# EAGLE design SecretMaze (EAGLE 7.6.0)
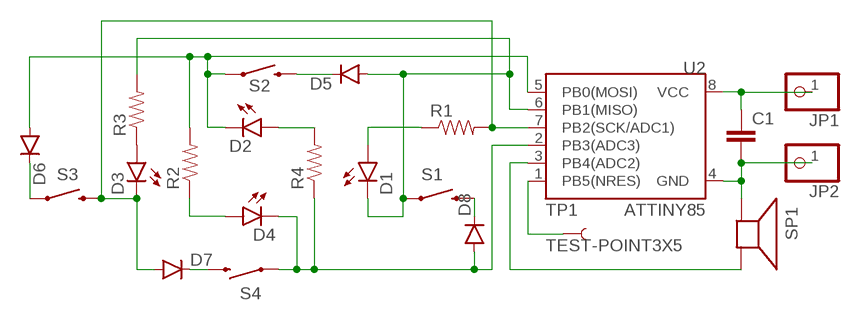
[diagram p0: schematic, sheet 1]

## Parts
C1  CAP_  [AXIAL-5MM]
D1  LED5MM  [LED5MM]
D2  LED5MM  [LED5MM]
D3  LED5MM  [LED5MM]
D4  LED5MM  [LED5MM]
D5  DIODEPTH  [DIODE-1N4001]
D6  DIODEPTH  [DIODE-1N4001]
D7  DIODEPTH  [DIODE-1N4001]
D8  DIODEPTH  [DIODE-1N4001]
JP1  PINHD-1X1CB  [1X01-CLEANBIG]
JP2  PINHD-1X1CB  [1X01-CLEANBIG]
R1  RESISTORPTH-1/4W  [AXIAL-0.4]
R2  RESISTORPTH-1/4W  [AXIAL-0.4]
R3  RESISTORPTH-1/4W  [AXIAL-0.4]
R4  RESISTORPTH-1/4W  [AXIAL-0.4]
S1  SWITCH-MOMENTARY-2PTH  [TACTILE-PTH]
S2  SWITCH-MOMENTARY-2PTH  [TACTILE-PTH]
S3  SWITCH-MOMENTARY-2PTH  [TACTILE-PTH]
S4  SWITCH-MOMENTARY-2PTH  [TACTILE-PTH]
SP1  SPEAKER/AL60P  [AL60P]
TP1  TEST-POINT3X5  [PAD.03X.05]
U2  ATTINY85  ATTINY45TINY85-20-DIP  [DIP08]

## Nets
N$1: D1.K(C) D5.A R3.P$2 S1.1 U2.6(PB1(MISO))
N$2: D7.C S4.3
N$3: SP1.2(-) U2.3(PB4(ADC2))
N$4: D3.K(C) D7.A R1.P$2 S3.3 U2.7(PB2(SCK/ADC1))
N$5: C1.P$2 JP2.1 SP1.1(+) U2.4(GND)
N$6: D8.C S1.3
N$7: D6.C S3.1
N$8: D2.A R4.P$2
N$9: D1.A R1.P$1
N$10: D3.A R3.P$1
N$11: D4.A R2.P$1
N$12: C1.P$1 JP1.1 U2.8(VCC)
N$13: D5.C S2.3
N$14: TP1.P$1 U2.1(PB5(NRES))
N$18: D2.K(C) D6.A R2.P$2 S2.1 U2.5(PB0(MOSI))
N$21: D4.K(C) D8.A R4.P$1 S4.1 U2.2(PB3(ADC3))

## Library data of the parts
C1 = SparkFun-Capacitors:CAP: Capacitor Standard 0603 ceramic capacitor, and 0.1" leaded capacitor.
D1-D4 = SparkFun-LED:LED: LEDs Standard schematic elements and footprints for 5mm, 3mm, 1206, and 0603 sized LEDs. 5mm - Spark Fun Electronics SKU : COM-00529 (and others)
D5-D8 = SparkFun-DiscreteSemi:DIODE: Diode These are standard reverse protection diodes and small signal diodes. SMA package can handle up to about 1A. SOD-323 can handle about 200mA. What the SOD-323 package when ordering, there are some mfgs out there that are 5-pin packages.
JP1 JP2 = adafruit:PINHD-1X1: Pin header 1x1 for 0.1" spacing With round pins
R1-R4 = SparkFun-Passives:RESISTOR: Resistor Basic schematic elements and footprints for 0603, 1206, and PTH resistors.
S1-S4 = SparkFun-Electromechanical:SWITCH-MOMENTARY-2: Various NO switches- pushbuttons, reed, etc; PROD_ID: SWCH-08441
SP1 = adafruit:SPEAKER: SPEAKER Source: Buerklin Added PS12 (for part # PS1240 piezo) http://www.ladyada.net/library/pcb/eaglelibrary.html
TP1 = SparkFun-Passives:TEST-POINT: Bare copper test points for troubleshooting or ICT
U2 = SparkFun-DigitalIC:ATTINY45: Atmel 8-pin 2/4/8kB flash uC; PROD_ID: IC-09445; VALUE: TINY85-20-DIP

## Board
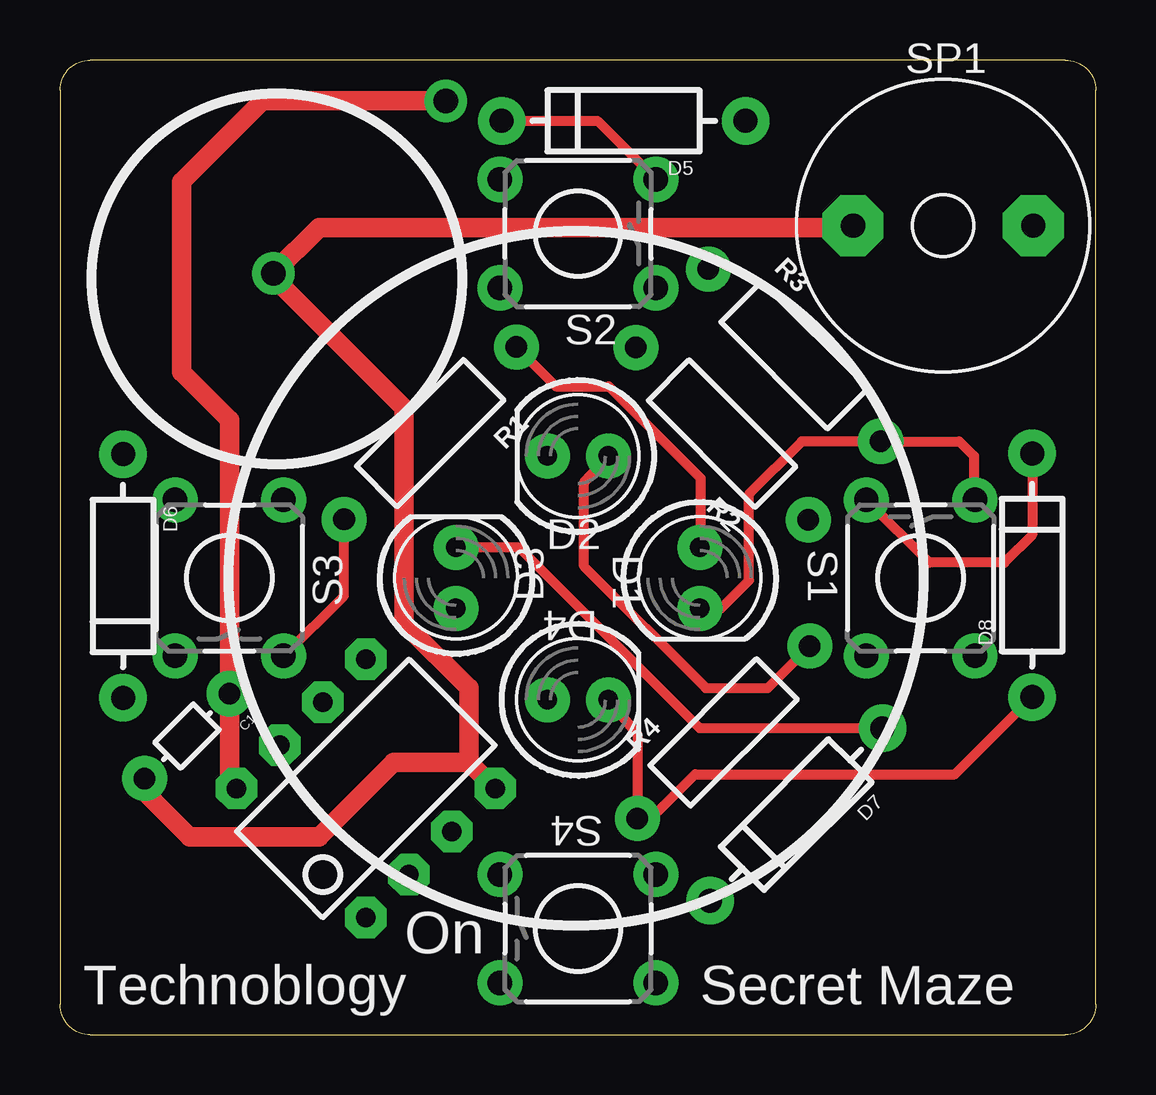
[diagram p1: board, top side]
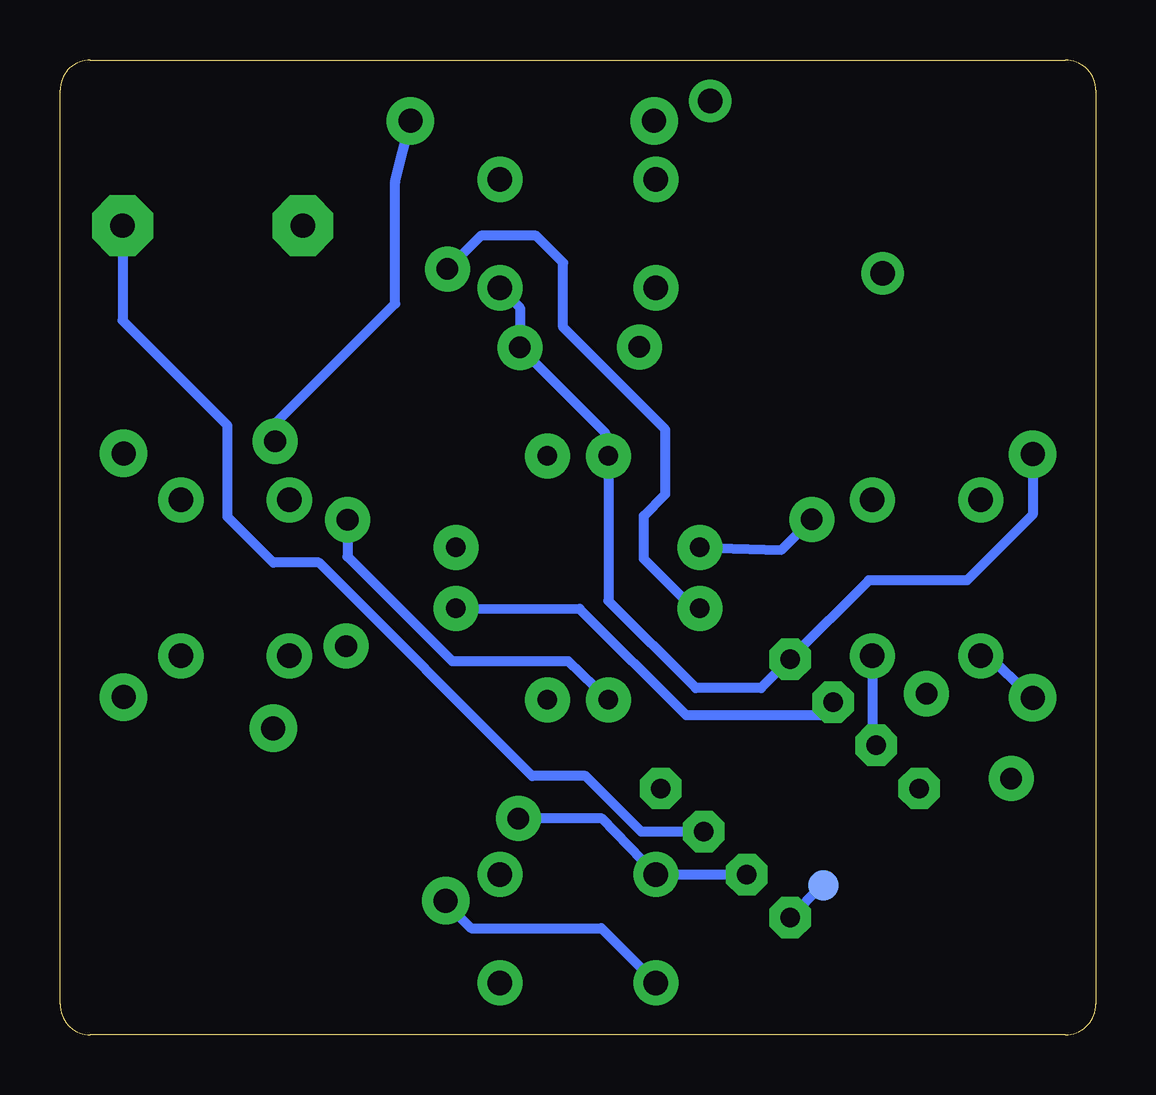
[diagram p2: board, bottom side, seen from below]

Size 43.18 x 40.64 mm. Coordinates in mm from the lower left corner, seen from the top.
Outline: 1.27,0 41.91,0 arc90 43.18,1.27 43.18,39.37 arc90 41.91,40.64 1.27,40.64 arc90 0,39.37 0,1.27 arc90 1.27,0
Copper layers (1*16): Top 0.035mm / dielectric 1.5mm / Bottom 0.035mm
Design rules "default": minimum track width 10mil, minimum drill 24mil, track to track 8mil, track to pad 8mil, pad to pad 8mil, via to via 8mil, smd to smd 8mil, copper to edge 40mil, drill to drill 8mil, minimum pad ring 10mil, minimum via ring 8mil, stop-mask expansion 4mil, vias tented up to drill 0mil, thermal gap 10mil

### Footprints (pad centres in the part's own frame; a part is rotated, then mirrored left to right if it is on the bottom)
AXIAL-5MM = drill 0.9 pad 1.88: P$1 -2.5,0; P$2 2.5,0
LED5MM = drill 0.813 pad 1.88: A -1.27,0; K 1.27,0
DIODE-1N4001 = drill 1 pad 1.981: A -5.08,0; C 5.08,0
1X01-CLEANBIG = drill 1.016 pad 1.778: 1 0,0
AXIAL-0.4 = drill 0.9 pad 1.88: P$1 -5.08,0; P$2 5.08,0
TACTILE-PTH = drill 1.016 pad 1.88: 1 -3.251,2.261; 2 3.251,2.261; 3 -3.251,-2.261; 4 3.251,-2.261
AL60P = drill 1.016 pad 2.54 octagon: 1 -3.759,0; 2 3.759,0
PAD.03X.05 = smd 1.27 x 1.27: P$1 0,0
DIP08 = drill 0.813 pad 1.727 octagon: 1 -3.81,-3.81; 2 -1.27,-3.81; 3 1.27,-3.81; 4 3.81,-3.81; 5 3.81,3.81; 6 1.27,3.81; 7 -1.27,3.81; 8 -3.81,3.81

### Placement (x,y rotation side)
C1  5.3,12.45 225 top
D1  26.67,19.05 270 top
D2  21.59,24.13 180 top
D3  16.51,19.05 90 top
D4  21.59,13.97 0 top
D5  23.5,38.1 180 top
D6  2.63,19.13 270 top
D7  30.69,9.19 225 top
D8  40.53,19.16 90 top
JP1  16.08,38.94 0 top
JP2  8.89,31.75 90 top
R1  15.43,25.08 225 top
R2  27.6,25.07 135 top
R3  30.62,28.33 315 top
R4  27.66,12.61 45 top
S1  35.88,19.05 270 top
S2  21.59,33.4 180 top
S3  7.06,19.05 90 top
S4  21.59,4.43 0 top
SP1  36.81,33.73 0 top
TP1  11.36,6.23 315 bottom
U2  12.75,10.28 45 top

### Tracks (layer width: path | path; a pad name or v marks a point on that pad's centre or on a via)
N$1
  Top 0.406: D1.K 27.54,17.76 28.72,18.95 28.72,22.54 30.92,24.74 R3.P$2 37.49,24.74 38.1,24.13 38.1,22.34 S1.1
  Bottom 0.406: D1.K 21.52,17.76 17.08,13.33 11.49,13.33 U2.6 | R3.P$2 34.21,25.48 29.21,30.48 29.21,35.56 D5.A
N$2
  Bottom 0.406: D7.C 27.18,5.6 26.04,4.45 20.62,4.45 S4.3
N$3
  Bottom 0.406: SP1.2 40.57,29.78 36.2,25.4 36.2,21.59 34.29,19.68 32.38,19.68 23.5,10.79 21.27,10.79 18.96,8.48 U2.3
N$4
  Top 0.406: S3.3 11.84,18.3 R1.P$2 | D3.K 19.14,20.31 26.54,12.91 26.67,12.78 D7.A
  Bottom 0.406: S3.3 9.32,15.71 9.32,12.23 U2.7 | D3.K 13.11,20.22 R1.P$2
N$5
  Top 0.813: 17.05,11.37 17.05,14.46 14.35,17.15 14.35,26.13 8.89,31.59 JP2.1 10.79,33.65 32.98,33.65 SP1.1 | 17.05,11.37 U2.4 18.14,10.22 | 17.05,11.37 13.91,11.37 10.79,8.26 5.4,8.26 3.53,10.12 C1.P$2
N$6
  Top 0.406: D8.C 40.53,20.84 39.37,19.68 36.23,19.68 S1.3
N$7
  Bottom 0.406: D6.C 4.64,15.95 S3.1
N$8
  Top 0.406: D2.A 21.85,23.04 21.85,19.53 26.92,14.46 29.5,14.46 R4.P$2
N$9
  Top 0.406: R1.P$1 20.67,27.03 22.88,27.03 26.7,23.21 26.7,20.36 D1.A
N$10
  Bottom 0.406: D3.A 16.68,17.68 18.84,19.84 18.84,21.64 17.94,22.54 17.94,25.23 22.21,29.5 22.21,32.19 23.33,33.31 25.64,33.31 R3.P$1
N$11
  Bottom 0.406: D4.A 22,15.58 26.83,15.58 31.19,19.94 R2.P$1
N$12
  Top 0.813: U2.8 7.06,10.58 C1.P$1 7.06,25.64 5.08,27.62 5.08,35.56 8.46,38.94 JP1.1
N$13
  Top 0.406: D5.C 22.4,38.1 S2.3
N$14
  Bottom 0.406: TP1.P$1 11.41,6.23 U2.1
N$18
  Bottom 0.406: S2.1 24.01,30.31 R2.P$2 20.46,25.11 D2.K 20.32,18.1 16.68,14.46 13.96,14.46 U2.5 9.47,18.95 5.37,18.95 2.63,21.68 D6.A
N$21
  Top 0.406: D4.K 24.07,12.5 R4.P$1 24.63,9.02 26.48,10.86 37.3,10.86 D8.A
  Bottom 0.406: 24.18,9.02 R4.P$1 20.59,9.02 S4.1 U2.2

### Text on the board
tPlace: On | Technoblogy | Secret Maze